# Altium schematic sheet Ups_Design2.SchDoc
size 381 x 241 mm; SheetNumber: 1; SheetTotal: 2
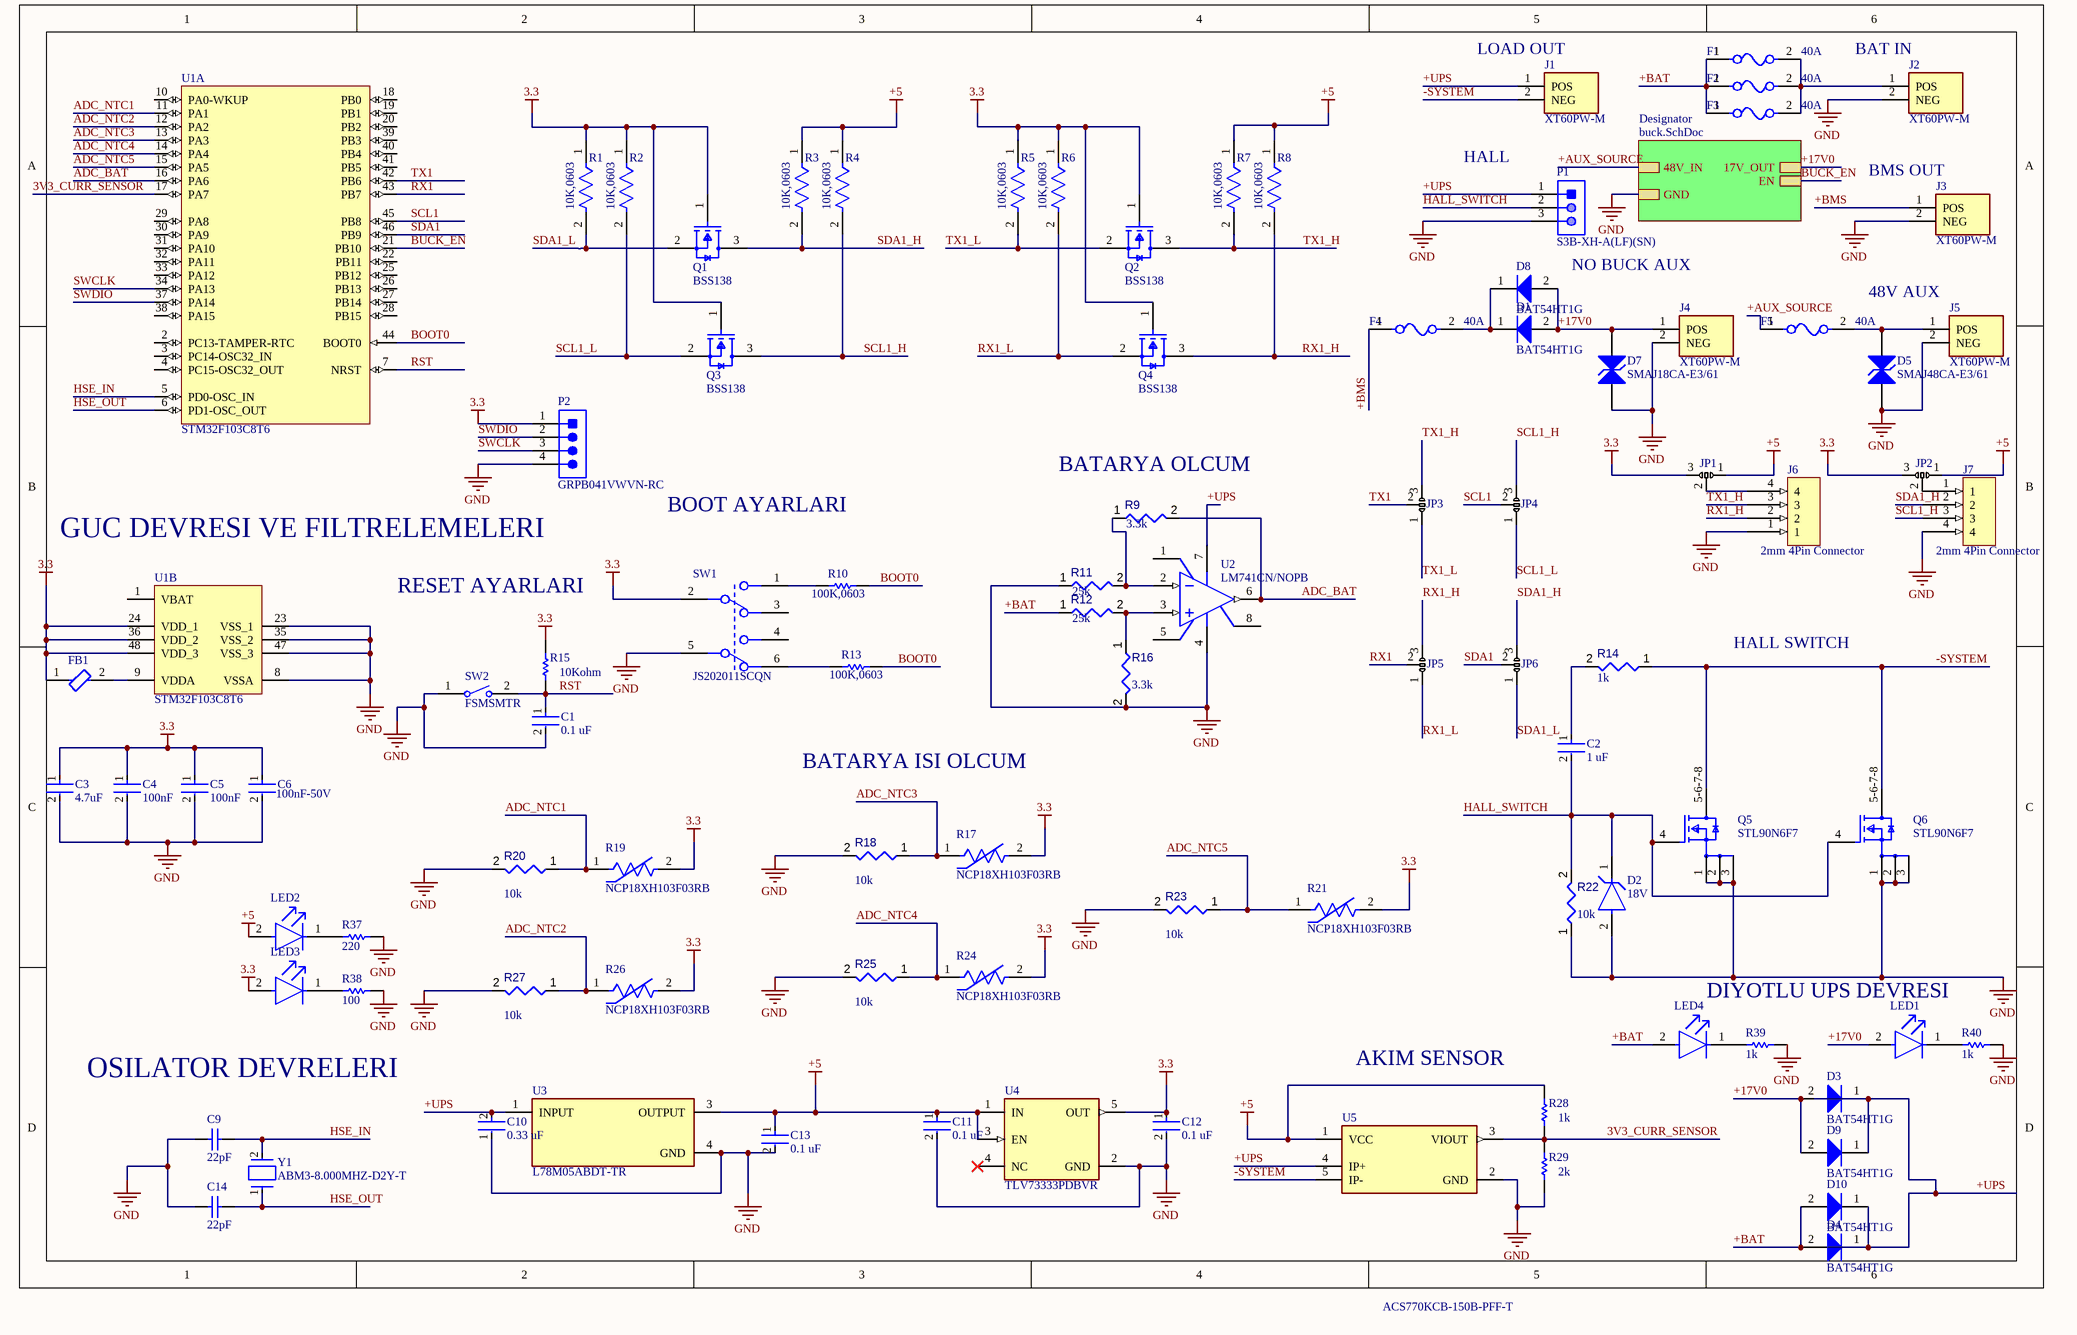
[diagram p0: Ups_Design2.SchDoc]

## Parts
C1  0.1 uF  [FP-GCM188-0_1-IPC_B]
C2  1 uF  [FP-0603-L_1_6_0_15-W_0_8-IPC_C]
C3  4.7uF  [FP-GRM188-0_2-IPC_C]
C4  100nF  [FP-CGA3E-0_3-0_1-IPC_A]
C5  100nF  [FP-CGA3E-0_3-0_1-IPC_A]
C6  100nF-50V  [FP-CGA3E-0_3-0_1-IPC_A]
C9  22pF  [CAPC1608X73X35LL10T15]
C10  0.33 uF  [FP-C1608-080-0_1-IPC_B]
C11  0.1 uF  [FP-GCM188-0_1-IPC_B]
C12  0.1 uF  [FP-GCM188-0_1-IPC_B]
C13  0.1 uF  [FP-GCM188-0_1-IPC_B]
C14  22pF  [CAPC1608X73X35LL10T15]
D1  BAT54HT1G  [ONSC-SOD-323-2-477-02_V]
D2  18V  [FP-SOD123-MFG]
D3  BAT54HT1G  [ONSC-SOD-323-2-477-02_V]
D4  BAT54HT1G  [ONSC-SOD-323-2-477-02_V]
D5  SMAJ48CA-E3/61  [VISH-DO-214AC-2_M]
D7  SMAJ18CA-E3/61  [VISH-DO-214AC-2_L]
D8  BAT54HT1G  [ONSC-SOD-323-2-477-02_V]
D9  BAT54HT1G  [ONSC-SOD-323-2-477-02_V]
D10  BAT54HT1G  [ONSC-SOD-323-2-477-02_V]
F1  40A  [FP-0456040_DR-MFG]
F2  40A  [FP-0456040_DR-MFG]
F3  40A  [FP-0456040_DR-MFG]
F4  40A  [FP-0456040_DR-MFG]
F5  40A  [FP-0456040_DR-MFG]
FB1  BLM18SG221TN1D  [FP-BLM18-0_15-t0_5-IPC_A]  (value not drawn)
J1  XT60PW-M  [AMASS_XT60PW-M]
J2  XT60PW-M  [AMASS_XT60PW-M]
J3  XT60PW-M  [AMASS_XT60PW-M]
J4  XT60PW-M  [AMASS_XT60PW-M]
J5  XT60PW-M  [AMASS_XT60PW-M]
J6  2mm 4Pin Connector  [New footprint 1]
J7  2mm 4Pin Connector  [New footprint 1]
JP1  Jumper Pad 3P  [Jumper Pad 3P-Footprint-1]  (value not drawn)
JP2  Jumper Pad 3P  [Jumper Pad 3P-Footprint-1]  (value not drawn)
JP3  Jumper Pad 3P  [Jumper Pad 3P-Footprint-1]  (value not drawn)
JP4  Jumper Pad 3P  [Jumper Pad 3P-Footprint-1]  (value not drawn)
JP5  Jumper Pad 3P  [Jumper Pad 3P-Footprint-1]  (value not drawn)
JP6  Jumper Pad 3P  [Jumper Pad 3P-Footprint-1]  (value not drawn)
LED1  TLMO1000-GS08  [FP-6_541-5056_01-4-MFG]  (value not drawn)
LED2  TLMO1000-GS08  [FP-6_541-5056_01-4-MFG]  (value not drawn)
LED3  TLMO1000-GS08  [FP-6_541-5056_01-4-MFG]  (value not drawn)
LED4  TLMO1000-GS08  [FP-6_541-5056_01-4-MFG]  (value not drawn)
P1  S3B-XH-A(LF)(SN)  [JST-S3B-XH-A(LF)(SN)_V]
P2  GRPB041VWVN-RC  [SLIN-GRPB041VWVN-RC_V]
Q1  BSS138  [FP-318-08-IPC_B]
Q2  BSS138  [FP-318-08-IPC_B]
Q3  BSS138  [FP-318-08-IPC_B]
Q4  BSS138  [FP-318-08-IPC_B]
Q5  STL90N6F7  [FP-8472137_SUBCON_998G-MFG]
Q6  STL90N6F7  [FP-8472137_SUBCON_998G-MFG]
R1  10K,0603  [FP-ERJ3G-IPC_C]
R2  10K,0603  [FP-ERJ3G-IPC_C]
R3  10K,0603  [FP-ERJ3G-IPC_C]
R4  10K,0603  [FP-ERJ3G-IPC_C]
R5  10K,0603  [FP-ERJ3G-IPC_C]
R6  10K,0603  [FP-ERJ3G-IPC_C]
R7  10K,0603  [FP-ERJ3G-IPC_C]
R8  10K,0603  [FP-ERJ3G-IPC_C]
R9  value 3.3k  [RESC1608X55X25ML10T15]  (hidden comment: 4.7k)
R10  100K,0603  [RESC1608X100X25ML20T15]
R11  25k  [RESC1608X55X25ML10T15]
R12  25k  [RESC1608X55X25ML10T15]
R13  100K,0603  [RESC1608X100X25ML20T15]
R14  1k  [RESC1608X55X25ML10T15]
R15  10Kohm  [RESC1608X55X25ML10T15]
R16  value 3.3k  [RESC1608X55X25ML10T15]  (hidden comment: 4.7k)
R17  NCP18XH103F03RB  [FP-NCP18-0_15-IPC_A]
R18  10k  [RESC1608X55X25ML10T15]
R19  NCP18XH103F03RB  [FP-NCP18-0_15-IPC_A]
R20  10k  [RESC1608X55X25ML10T15]
R21  NCP18XH103F03RB  [FP-NCP18-0_15-IPC_A]
R22  10k  [RESC1608X55X25ML10T15]
R23  10k  [RESC1608X55X25ML10T15]
R24  NCP18XH103F03RB  [FP-NCP18-0_15-IPC_A]
R25  10k  [RESC1608X55X25ML10T15]
R26  NCP18XH103F03RB  [FP-NCP18-0_15-IPC_A]
R27  10k  [RESC1608X55X25ML10T15]
R28  1k  [RESC1608X55X25ML10T15]
R29  2k  [RESC1608X55X25ML10T15]
R37  220  [RESC1608X55X25ML10T15]
R38  100  [RESC1608X55X25ML10T15]
R39  1k  [RESC1608X55X25ML10T15]
R40  1k  [RESC1608X55X25ML10T15]
SW1  JS202011SCQN  [FP-JS202011SCQN-MFG]
SW2  FSMSMTR  [TECO-FSMSMTR_V]
U1  STM32F103C8T6  [STM-LQFP48_L]  (parts A,B of 2)
U2  LM741CN/NOPB  [P0008A]
U3  L78M05ABDT-TR  [FP-L78M05ABDT-TR-MFG]
U4  TLV73333PDBVR  [FP-DBV0005A-MFG]
U5  ACS770KCB-150B-PFF-T  [FP-CB-5-PFF-MFG]
Y1  ABM3-8.000MHZ-D2Y-T  [FP-ABM3-MFG]

## Sub-sheets
Designator = buck.SchDoc: 48V_IN, GND, 17V_OUT, EN

## Nets
3.3: C3.1 C4.1 C5.1 C6.1 C12.1 FB1.1 JP1.3 JP2.3 LED3.2(A) P2.1 Q1.1(G) Q2.1(G) Q3.1(G) Q4.1(G) R1.1 R2.1 R5.1 R6.1 R15.2 R17.2 R19.2 R21.2 R24.2 R26.2 SW1.2 U1.24(VDD_1) U1.36(VDD_2) U1.48(VDD_3) U4.5(OUT)
+5: C11.1 C13.1 JP1.1 JP2.1 LED2.2(A) R3.1 R4.1 R7.1 R8.1 R28.2 U3.3(OUTPUT) U4.1(IN) U4.3(EN) U5.1(VCC)
GND: C1.2 C3.2 C4.2 C5.2 C6.2 C9.1 C10.1 C11.2 C12.2 C13.2 C14.1 D2.2(A) D5.1(A1) D7.1(A1) J2.2(NEG) J3.2(NEG) J4.2(NEG) J5.2(NEG) J6.1 J7.4 P1.3 P2.4 Q5.1(S) Q5.2(S) Q5.3(S) Q6.1(S) Q6.2(S) Q6.3(S) R11.1 R16.2 R18.2 R20.2 R22.1 R23.2 R25.2 R27.2 R29.1 R37.1 R38.1 R39.1 R40.1 SW1.5 SW2.1 U1.8(VSSA) U1.23(VSS_1) U1.35(VSS_2) U1.47(VSS_3) U2.4(V-) U3.4(GND) U4.2(GND) U5.2(GND) ; sheet Designator/GND
3V3_CURR_SENSOR: R28.1 R29.2 U1.17(PA7) U5.3(VIOUT)
+17V0: D1.2(A) D3.2(A) D7.2(A2) D8.2(A) D9.2(A) J4.1(POS) LED1.2(A) ; sheet Designator/17V_OUT
+AUX_SOURCE: F5.1 ; sheet Designator/48V_IN
+BAT: D4.2(A) D10.2(A) F1.1 F2.1 F3.1 LED4.2(A) R12.1
+BMS: F4.1 J3.1(POS)
+UPS: C10.2 D3.1(K) D4.1(K) D9.1(K) D10.1(K) J1.1(POS) P1.1 U2.7(V+) U3.1(INPUT) U5.4(IP+)
-SYSTEM: J1.2(NEG) Q5.5-6-7-8(D) Q6.5-6-7-8(D) R14.1 U5.5(IP-)
ADC_BAT: R9.2 U1.16(PA6) U2.6(OUT)
ADC_NTC1: R19.1 R20.1 U1.11(PA1)
ADC_NTC2: R26.1 R27.1 U1.12(PA2)
ADC_NTC3: R17.1 R18.1 U1.13(PA3)
ADC_NTC4: R24.1 R25.1 U1.14(PA4)
ADC_NTC5: R21.1 R23.1 U1.15(PA5)
BOOT0: R10.1 R13.1 U1.44(BOOT0)
BUCK_EN: U1.21(PB10) ; sheet Designator/EN
HALL_SWITCH: C2.2 D2.1(C) P1.2 Q5.4(G) Q6.4(G) R22.2
HSE_IN: C9.2 U1.5(PD0-OSC_IN) Y1.2
HSE_OUT: C14.2 U1.6(PD1-OSC_OUT) Y1.1
RST: C1.1 R15.1 SW2.2 U1.7(NRST)
RX1: JP5.2 U1.43(PB7)
RX1_H: J6.2 JP5.3 Q4.3(D) R8.2
RX1_L: JP5.1 Q4.2(S) R6.2
SCL1: JP4.2 U1.45(PB8)
SCL1_H: J7.3 JP4.3 Q3.3(D) R4.2
SCL1_L: JP4.1 Q3.2(S) R2.2
SDA1: JP6.2 U1.46(PB9)
SDA1_H: J7.2 JP6.3 Q1.3(D) R3.2
SDA1_L: JP6.1 Q1.2(S) R1.2
SWCLK: P2.3 U1.34(PA13)
SWDIO: P2.2 U1.37(PA14)
TX1: JP3.2 U1.42(PB6)
TX1_H: J6.3 JP3.3 Q2.3(D) R7.2
TX1_L: JP3.1 Q2.2(S) R5.2
NetC2_1: C2.1 R14.2
NetD1_1: D1.1(K) D8.1(K) F4.2
NetD5_2: D5.2(A2) F5.2 J5.1(POS)
NetF1_2: F1.2 F2.2 F3.2 J2.1(POS)
NetFB1_2: FB1.2 U1.9(VDDA)
NetJ6_4: J6.4 JP1.2
NetJ7_1: J7.1 JP2.2
NetLED1_1: LED1.1(C) R40.2
NetLED2_1: LED2.1(C) R37.2
NetLED3_1: LED3.1(C) R38.2
NetLED4_1: LED4.1(C) R39.2
NetR9_1: R9.1 R11.2 U2.2(IN-)
NetR10_2: R10.2 SW1.1
NetR12_2: R12.2 R16.1 U2.3(IN+)
NetR13_2: R13.2 SW1.6

Not connected (* = marked no-connect by the designer): SW1 3 4; U1 1(VBAT) 2(PC13-TAMPER-RTC) 3(PC14-OSC32_IN) 4(PC15-OSC32_OUT) 10(PA0-WKUP) 18(PB0) 19(PB1) 20(PB2) 22(PB11) 25(PB12) 26(PB13) 27(PB14) 28(PB15) 29(PA8) 30(PA9) 31(PA10) 32(PA11) 33(PA12) 38(PA15) 39(PB3) 40(PB4) 41(PB5); U2 1(OFS_NULL) 5(OFS_NULL) 8(NC); U4 4(NC)*

## Notes on the sheet
- (near J1) LOAD OUT
- (near J2) BAT IN
- HALL
- (near J3) BMS OUT
- NO BUCK AUX
- 48V AUX
- (near R9) BATARYA OLCUM
- GUC DEVRESI VE FILTRELEMELERI
- BOOT AYARLARI
- RESET AYARLARI
- HALL SWITCH
- BATARYA ISI OLCUM
- DIYOTLU UPS DEVRESI
- OSILATOR DEVRELERI
- AKIM SENSOR

## Library data of the parts
C1 C11-C13 = CMP-2006-02353-3: Ceramic Capacitor for Automotive 100nF  ±10% 50VDC X8L 0603 Paper T/R; Voltage Rating: 50V; Height: 0.8mm; Lead Free: Lead Free; Case/Package: 0603; Dielectric: X8L; Packaging: Tape and Reel; Termination: SMD/SMT; Package Quantity: 4000; Width: 0.5mm; Max Operating Temperature: 150°C; Case Code (Metric): 1608; Thickness: 0.035inch; Capacitance: 100nF; Tolerance: 10%; Voltage Rating (DC): 50V; Ratings: AEC-Q200; Case Code (Imperial): 0603; Voltage: 50V; Depth: 0.8mm; Radiation Hardening: No; Length: 1.6mm; Mount: Surface Mount; Min Operating Temperature: -55°C
C2 = CMP-2000-07531-4: Ceramic Capacitor General Use 1uF ±10% 50V X7R 0603; Series: M; Width: 0.031inch; Mount: Surface Mount; Radiation Hardening: No; Voltage Rating (DC): 50V; Packaging: Tape and Reel; Termination: SMD/SMT; Depth: 0.8mm; Case Code (Metric): 1608; Case Code (Imperial): 0603; Height: 0.8mm; Voltage Rating: 50V; Package Quantity: 1; Halogen Free: Halogen Free; Dielectric: X7R; Min Operating Temperature: -55°C; Length: 1.6mm; Construction: Flat; Tolerance: 10%; Thickness: 0.037inch; Max Operating Temperature: 125°C; Case/Package: 0603; Capacitance: 1uF; RoHS Compliant: Yes
C3 = CMP-2006-02545-2: Chip Multilayer Ceramic Capacitors for General Purpose, 0603, 4.7uF, X5R, 15%, 10%, 35V; Lead Free: Lead Free; Max Operating Temperature: 85°C; Case Code (Imperial): 0603; Capacitance: 4.7uF; Width: 0.8mm; Thickness: 0.031inch; Case Code (Metric): 1608; Min Operating Temperature: -55°C; Voltage Rating (DC): 35V; Dielectric: X5R; Voltage: 35V; Packaging: Tape and Reel; Resistor Type: Ceramic; Weight: 0.000222oz; Mount: Surface Mount; Material: Ceramic; Depth: 0.8mm; Tolerance: 10%; REACH SVHC: No SVHC; Case/Package: 0603; Voltage Rating: 35V; Package Quantity: 4000; Height: 0.8mm; Length: 1.6mm; Termination: SMD/SMT
C4-C6 = CMP-2000-07546-2: Cap Ceramic 100nF 50V X7R 10% Pad SMD 0603 +125°C Automotive T/R; Weight: 7.1E-05oz; Composition: Ceramic; Max Operating Temperature: 125°C; Termination: SMD/SMT; Dielectric: X7R; Length: 1.6mm; Package Quantity: 1; REACH SVHC: No SVHC; Lead Free: Lead Free; Case Code (Metric): 1608; Min Operating Temperature: -55°C; Packaging: Tape and Reel; Tolerance: 10%; Voltage Rating: 50V; Case Code (Imperial): 0603; Capacitance: 100nF; Case/Package: 0603; Voltage Rating (DC): 50V; Depth: 0.8mm; Radiation Hardening: No; Ratings: AEC-Q200; Mount: Surface Mount; Voltage: 50V; Thickness: 0.035inch; Width: 0.8mm; Height: 0.8mm
C9 C14 = CMP-2006-04604-1: Part Number: 06033J220GBSTR; Manufacturer: AVX Interconnect / Elco
C10 = CMP-2000-07551-2: Multilayer Ceramic Capacitors 330nF ±10% 50V X7R SMD 0603; Capacitance: 330nF; Case Code (Imperial): 0603; Case Code (Metric): 1608; Dielectric: X7R; Length: 1.6mm; Construction: Flat; Resistor Type: Ceramic; Mount: Surface Mount; Voltage Rating: 50V; Packaging: Tape and Reel; Series: C; Case/Package: 0603; Lead Free: Lead Free; Tolerance: 10%; Voltage: 50V; REACH SVHC: No SVHC; Height: 0.8mm; Weight: 7.1E-05oz; Termination: SMD/SMT; Max Operating Temperature: 125°C; RoHS Compliant: Yes; Min Operating Temperature: -55°C; Depth: 0.8mm; Package Quantity: 1; Thickness: 0.037inch; Voltage Rating (DC): 50V; Dielectric Material: Ceramic; Width: 0.031inch
D1 D3 D4 D8-D10 = CMP-1055-00462-1: Schottky Barrier Diode, 2-Pin SOD-323, Pb-Free, Tape and Reel; Manufacturer: On Semiconductor; Configuration: Single; trr Max (ns): 5; IFSM Max (A): 0.6; ComponentLink3URL: http://www.onsemi.com/pub_link/Collateral/477-02.PDF.1; PackageDescription: 2-Pin SOD, Body 1.7 x 1.25 mm; ComponentLink2URL: http://www.onsemi.cn/pub_link/Collateral/BAT54HT1-D.PDF; ComponentLink3Description: Package Specification; ComponentLink2Description: Datasheet; DatasheetVersion: Rev. 6; PackageReference: SOD-323-2-477-02; RoHS: TRUE; ComponentLink1URL: http://www.onsemi.com/; Packing: Tape and Reel; PartNumber: BAT54HT1G; Mounting Technology: Surface Mount; ComponentLink1Description: Manufacturer URL; PackageVersion: Rev. H, 03/2007
D2 = CMP-12792-000007-1: DIODE ZENER 18V 500MW SOD123; Manufacturer: Diodes Inc.; Manufacturer Part Number: BZT52C18-7-F; Max Reverse Leakage Current: 0.1uA; Max Zener Voltage: 19.1V; Max Junction Temp: +150°C; Reverse Voltage: 12.6V; Forward Current: 10mA; Standoff Height: 0mm; Zener Impedance: 45Ω; Power Dissipation: 370mW; Temperature Range Low: -65°C; Package: SOD123; Device Class L3: Zener Diodes; Mouser Description: BZT52C18 Series 500 mW 18 V 10 mA Surface Mount Zener Diode - SOD-123; Octopart: https://octopart.com/bzt52c18-7-f-diodes+inc.-326572; Height: 1.45mm; Device Class L1: Discrete Semiconductors; Nom Zener Voltage: 18V; Automotive: No; Device Class L2: Diodes; Category: Diode; Temperature: -65°C to +150°C; Lead Free: Yes; ComponentLink2URL: https://www.diodes.com/assets/Datasheets/ds18004.pdf; Temperature Range High: +150°C; Footprint Url: https://www.diodes.com/assets/Package-Files/SOD123.pdf; RoHS: TRUE; Digikey Description: DIODE ZENER 18V 500MW SOD123; ComponentLink2Description: Datasheet
D5 = CMP-0548-00214-2: Transient Voltage Suppressor, 6.40 to 231 V, 48 V Stand-off Voltage, Bi-Directional, -55 to 155 degC, 2-pin DO-214AC, Pb-Free, Tape and Reel; Manufacturer: Vishay Semiconductor; PPPM (W): 400, 300; ID (uA): 2; VBR Bi-Directional (V): 6.4 to 231; VWM (V): 48; IFSM: 40 A; Mounting Technology: Surface Mount; PackageReference: DO-214AC-2; ComponentLink1Description: Manufacturer URL; ComponentLink2Description: Datasheet; ComponentLink3Description: Package Specification; PartNumber: SMAJ48CA-E3/61; ComponentLink1URL: http://www.vishay.com/; ComponentLink3URL: http://www.vishay.com/docs/88390/smaj50a.pdf; ComponentLink2URL: http://www.vishay.com/docs/88390/smaj50a.pdf; RoHS: TRUE; Operating Junction and Storage Temperature Range: -55 to 150 degC; PackageDescription: 2-Pin DO-214AC (SMA), Body 4.245 x 2.665 mm; Packing: Tape and Reel; DatasheetVersion: 12/8/2013
D7 = CMP-0548-00180-2: Transient Voltage Suppressor, 6.40 to 231 V, 18 V Stand-off Voltage, Bi-Directional, -55 to 155 degC, 2-pin DO-214AC, Pb-Free, Tape and Reel; Manufacturer: Vishay Semiconductor; VWM (V): 18; IFSM: 40 A; VBR Bi-Directional (V): 6.4 to 231; ID (uA): 2; PPPM (W): 400, 300; PackageDescription: 2-Pin DO-214AC (SMA), Body 4.245 x 2.665 mm; ComponentLink1Description: Manufacturer URL; RoHS: TRUE; ComponentLink3Description: Package Specification; ComponentLink3URL: http://www.vishay.com/docs/88390/smaj50a.pdf; Mounting Technology: Surface Mount; DatasheetVersion: 12/8/2013; ComponentLink1URL: http://www.vishay.com/; ComponentLink2URL: http://www.vishay.com/docs/88390/smaj50a.pdf; PackageReference: DO-214AC-2; ComponentLink2Description: Datasheet; PartNumber: SMAJ18CA-E3/61; Packing: Tape and Reel; Operating Junction and Storage Temperature Range: -55 to 150 degC
F1-F5 = CMP-08605-000062-1: FUSE BOARD MOUNT 40A 60VDC 2SMD; Manufacturer Part Number: 0456040.DR; Manufacturer: Littelfuse Inc; Fuse Blow Speed: Fast; Voltage Rating: 72V; Resistance: 1.05mΩ; Fuse I2T: 191A2Sec; Fuse Interrupt Dc Current: 180A; Value: 1.05mΩ; Fuse Current: 40A; Device Class L2: Fuses; Height: 4.445mm; Device Class L3: unset; Max Fuse Dc Voltage: 72V; Lead Free: Yes; Device Class L1: Circuit Protection; Octopart: https://octopart.com/0456040.dr-littelfuse-18189767; Automotive: No; Temperature: -55°C to +125°C; ComponentLink2Description: Datasheet; RoHS: TRUE; Temperature Range Low: -55°C; Digikey Description: FUSE BOARD MOUNT 40A 60VDC 2SMD; Mouser Description: Surface Mount Fuses 125V V/FA NANO2 40A; ComponentLink2URL: https://www.littelfuse.com/~/media/electronics/datasheets/fuses/littelfuse_fuse_456_datasheet.pdf.pdf; Temperature Range High: +125°C; Package: 0; Category: Fuse
FB1 = CMP-0686-00596-3: Chip Ferrite Bead, 0603, 220Ω @ 100MHz, 25%, 0.04Ω, 2.5A; Impedance: 220R; DC Resistance-Max: 40mR; Number of Circuits: 1; Test Frequency: 100MHz; Material: Ferrite; Lead Free: Lead Free; Width: 0.8mm; Max Current Rating: 2.5A; Termination: SMD/SMT; Depth: 0.95mm; Packaging: Tape and Reel; Case Code (Metric): 1608; DC Current: 2.5A; Weight: 7.1E-05oz; Min Operating Temperature: -55°C; DC Resistance (DCR): 40mR; Max Operating Temperature: 125°C; Core Material: Ferrite; Max DC Current: 2.5A; Case/Package: 0603; REACH SVHC: No SVHC; Height: 0.8mm; Number of Pins: 2; Tolerance: 25%; RoHS Compliant: Yes; Radiation Hardening: No; Current Rating: 2.5A; Number of Lines: 1; Series: BLM18S; Case Code (Imperial): 0603; Length: 1.6mm; Package Quantity: 1
J1-J5 = XT60PW-M: Socket, DC supply, male, PIN: 2; MF: AMASS; Check_prices: https://www.snapeda.com/parts/XT60PW-M/AMASS/view-part/?ref=eda; SnapEDA_Link: https://www.snapeda.com/parts/XT60PW-M/AMASS/view-part/?ref=snap; Price: None; Availability: Not in stock; Package: Package; MP: XT60PW-M; Value: *
J6 J7 = CMP-002-00080-1
JP1-JP6 = CMP-011-00014-1: 3Pin Jumper Pad SWH
LED1-LED4 = CMP-02520-000010-1: LED ORANGE 0603 SMD; Manufacturer: Vishay; Automotive Grade: Grade 2; Luminous Intensity: 7.5mcd; Forward Current: 2mA; Forward Voltage: 1.8V; Led Orientation: Top View; Power Dissipation: 40mW; Max Junction Temp: +120°C; Wavelength: 605nm; Viewing Angle: 160°; Peak Emmision Wavelength: 610nm; Reverse Voltage: 6V; Colour: Orange; Digikey Description: LED ORANGE 0603 SMD; Lead Free: Yes; RoHS: TRUE; Device Class L1: Optoelectronics; Automotive: Yes; Manufacturer Part Number: TLMO1000-GS08; Category: Diode; Device Class L3: unset; Temperature Range Low: -40°C; Temperature Range High: +100°C; Ambient Temperature Range High: +100°C; ComponentLink2URL: http://www.vishay.com/docs/83172/tlmo1000.pdf; Height: 0.65mm; Ambient Temperature Range Low: -40°C; Device Class L2: LEDs; Octopart: https://octopart.com/tlmo1000-gs08-vishay-41955669; Temperature: -40°C to +100°C; ComponentLink2Description: Datasheet; Package: 6.541-5056.01-4
P1 = CMP-1755-00006-1: Male Header, Pitch 2.5 mm, 1 x 3 Position, Height 6.1 mm, Tail Length 3.4 mm, -25 to 85 degC, RoHS, Bulk; Min Supply Voltage: 1 V; Frequency: 1.8 MHz; Channels: 1; Nominal Supply Current: 170 uA; Max Power Dissipation: 1 W; Max Ouput Current: -10 mA; Case\Package: DIP; Max Supply Voltage: 15 V; Min Operating Temperature: 0 degC; Weight: 0.015535 oz; Radiation Hardening: No; ComponentLink1URL: http://www.jst.com/home2.html; PackageReference: S3B-XH-A(LF)(SN); Length: 9.81 mm; Max Operating Temperature: 70 degC; Package Quantity: 50; REACH SVHC: No SVHC; Mount: Through Hole; Pins: 8; Height: 4.57 mm; DatasheetVersion: May-16; ComponentLink1Description: Manufacturer URL; PackageDescription: Male Header, Pitch 2.5 mm, 1 x 3 Position, Height 6.1 mm, Tail Length 3.4 mm; RoHSCompliant: true; Packaging: Rail/Tube; Width: 6.35 mm; ComponentLink2URL: http://www.jst-mfg.com/product/pdf/eng/eXH.pdf; ComponentLink2Description: Datasheet
P2 = CMP-2000-06373-1: Male Header, Pitch 1.27 mm, 1 x 4 Position, Height 4 mm, Tail Length 2.3 mm, -40 to 105 degC, RoHS, Bulk; Manufacturer: Sullins; Mating Products: S9010E-04-ND / -CONNHEADER.050"4POSR/APCB / S9008E-04-ND / -CONNHEADER.050"4POSPCBGOLD / S9005E-04-ND / -CONNHEADER.050"4POSSMDGOLD; Other Names: S9014E-04; Dynamic Catalog: GRPB; Pitch: 0.050"(1.27mm); Number of Positions Loaded: All; Number of Positions: 4; Catalog Drawings: S9014ESeriesTop; Connector Type: Header,Unshrouded; Contact Finish Thickness: Flash; Number of Rows: 1; Contact Type: MalePin; Category: Connectors,Interconnects; Contact Mating Length: 0.118"(3.00mm); Family: RectangularConnectors-Headers,MalePins; Datasheet Version: Rev. C, 12/2008; Contact Finish: Gold; Termination: Solder; Manufacturer URL: http://www.sullinscorp.com/; Mounting Type: ThroughHole; Packaging: Bulk; Package Reference: GRPB041VWVN-RC; Datasheet URL: http://www.sullinscorp.com/drawings/71_GRPB___1VWVN-RC,_10957-C.pdf; Mounting Technology: ThroughHole; Package Description: Male Header, Pitch 1.27 mm, 1 x 4 Position, Height 4 mm, Tail Length 2.3 mm; Standard Package: 1
Q1-Q4 = CMP-07173-000101-1: MOSFET N-CH 50V 220MA SOT-23; Turn-Off Delay Time: 20ns; Element Configuration: Single; Rds On Max: 3.5R; Gate to Source Voltage (Vgs): 20V; Threshold Voltage: 1.3V; Number of Elements: 1; Power Dissipation: 360mW; Rise Time: 9ns; Turn-On Delay Time: 2.5ns; Input Capacitance: 27pF; On-State Resistance: 6R; Lead Free: Lead Free; Length: 2.92mm; Width: 1.3mm; Drain to Source Breakdown Voltage: 50V; Min Operating Temperature: -55°C; REACH SVHC: No SVHC; Packaging: Tape and Reel; Radiation Hardening: No; Height: 0.93mm; Drain to Source Voltage (Vdss): 50V; Current Rating: 220mA; Voltage Rating (DC): 50V; Weight: 0.03g; Continuous Drain Current (ID): 220mA; Number of Pins: 3; Nominal Vgs: 1.3V; Max Power Dissipation: 360mW; Fall Time: 9ns; Drain to Source Resistance: 3.5R; Contact Plating: Tin; Case/Package: SOT-23; Package Quantity: 1; Dual Supply Voltage: 50V; Mount: Surface Mount; Termination: SMD/SMT; Max Operating Temperature: 150°C
Q5 Q6 = CMP-12198-000042-1: MOSFET N-CH 60V 90A POWERFLAT; Rds On Max: 5.4mR; Input Capacitance: 1.6nF; Max Power Dissipation: 94W; Number of Pins: 8; Packaging: Cut Tape; Continuous Drain Current (ID): 90A; Lead Free: Lead Free; Mount: Surface Mount; Drain to Source Voltage (Vdss): 60V; Series: STripFET™ F7
R1-R8 = CMP-2000-00704-2: RES SMD 10K OHM 5% 1/10W 0603; Temperature Coefficient: 200ppm/°C; Max Power Dissipation: 100mW; Resistance: 10kR; Voltage Rating (DC): 50V; Voltage Rating: 75V; Resistor Type: Thick Film; Tolerance: 5%; Military Standard: Not; Package Quantity: 1; Max Operating Temperature: 155°C; Mount: Surface Mount; Technology: THICK FILM; Case/Package: 0603; Construction: Rectangular; Depth: 0.8mm; Case Code (Imperial): 0603; Weight: 7.1E-05oz; Features: Automotive AEC-Q200; Packaging: Tape and Reel; Width: 0.8mm; Length: 1.6mm; Termination: SMD/SMT; Power Rating: 100mW; Lead Free: Lead Free; Number of Terminations: 2; Height: 0.45mm; RoHS Compliant: Yes; Min Operating Temperature: -55°C; Contact Plating: Tin; REACH SVHC: No SVHC; Resistance Tolerance: 5%; Series: ERJ; Working Voltage: 75V; Case Code (Metric): 1608
R9 R11 R12 R14 R16 R18 R20 R22 R23 R25 R27 = CMP-009-00014-4: Chip Resistor, 1 KOhm, +/-1%, 0.1 W, -55 to 155 degC, 0603 (1608 Metric); Power: 100mW; Tolerance: 1%; Voltage Rating: 50V; Max Operating Temperature: 155°C; Pins: 2; RoHS Compliant: True; Case/Package: 0603; Min Operating Temperature: -55°C; Mounting Technology: SM
  R11 R12: Value: 25k
  R14: Value: 1k
  R18 R20 R22 R23 R25 R27: Value: 10k
R10 R13 = CMP-2000-03662-1: Manufacturer: Vishay Dale; Part Number: NTHS0603N01N1003JE
R15 R28 R29 R37-R40 = CMP-2000-04238-1: Manufacturer: Yageo; Part Number: RC0603JR-070RA
R17 R19 R21 R24 R26 = CMP-2000-05271-3: NTC Thermistor for Temperature Sensor, 0603, 10kΩ, 1%, 0.1mA, 5V; Manufacturer Series: NCP18; Accuracy: 0.7%; Current Rating: 310uA; Max Power Dissipation: 100mW; Thermistor Application: TEMPERATURE COMPENSATION; Number of Terminals/Pins: 2; Resistance: 10kR; Case Code (Metric): 1608; RoHS Compliant: Yes; Max Operating Temperature: 125°C; Resistance Tolerance: 1%; Case/Package: 0603; Mount: Surface Mount; Lead Free: Lead Free; Min Operating Temperature: -40°C; REACH SVHC: No SVHC; Package Shape: Rectangular; Radiation Hardening: No; Series: NCP; Depth: 0.8mm; Number of Pins: 2; Length: 1.6mm; Height: 0.8mm; Terminal Placement: Dual; Tolerance: 1%; Case Code (Imperial): 0603; Terminal Finish: Tin; Power Rating: 100mW; Termination: SMD/SMT; Packaging: Tape and Reel; Package Quantity: 1
SW1 = CMP-2000-05087-3: SWITCH SLIDE DPDT 300MA 6V; Switch Function: On-On; Actuator Type: Standard; Switch Travel: 2mm; Actuator Color: Black; Contact Resistance: 70mR; Electrical Life: 5000Cycles; Actuator Material: Nylon; REACH SVHC: No SVHC; Series: JS; Min Operating Temperature: -20°C; Depth: 7.5mm; Housing Material: Nylon; Voltage Rating (DC): 6V; Max Operating Temperature: 85°C; Contact Current Rating: 300mA; Package Quantity: 1; Contact Plating: Silver; Contact Material: Copper Alloy; Throw Configuration: DPDT; Current Rating: 300mA; Orientation: Vertical; Max Current Rating: 300mA; Max Voltage Rating (DC): 6V; Flammability Rating: UL94 V-2; Length: 9mm; Packaging: Tape and Reel; Mount: Surface Mount; Actuator Length: 2mm; Lead Free: Lead Free; Termination: Gull Wing; Radiation Hardening: No
SW2 = CMP-2000-07501-1: FSMSM Push Button Switch, 50 mA, -35 to 85 degC, 2-Pin SMD, RoHS, Tape and Reel; Manufacturer: TE Connectivity; Voltage Rating (DC): 24V; Electrical Life: 20000Cycles; Operating Force: 180gf; Switch Travel: 0.25mm; Contact Current Rating: 50mA; Case\/Package: SMD/SMT; Actuator Length: 1.07mm; Throw Configuration: SPST; Actuator Material: Polyamide; Contact Resistance: 100mOhm; Illumination Type: Illuminated; Max Voltage Rating (DC): 12V; Manufacturer URL: http://www.te.com/; Lead Free: LeadFree; Packaging: TapeandReel; Min Operating Temperature: -35degC; Mechanical Life: 20000Cycles; Mount: SurfaceMount; REACH SVHC: Unknown; Package Quantity: 1800; Package Reference: FSMSMTR; RoHSCompliant: true; Max Operating Temperature: 85degC; Orientation: Straight; ELV: Compliant; Datasheet URL: http://www.te.com/commerce/DocumentDelivery/DDEController?Action=showdoc&DocId=Customer+Drawing%7F1437566-3%7FC2%7Fpdf%7FEnglish%7FENG_CD_1437566-3_C2_1437566_3_1_c.dwg.pdf%7F1437566-4; Package Description: 2-Pin Surface Mount Device, Body 6 x 3.5 mm, Pitch 9.19 mm; Current Rating: 50mA; Contact Plating: Silver; Termination: GullWing; Datasheet Version: Rev. C2, 08/2014; Contact Material: Brass; Mounting Technology: SurfaceMount
U1 = CMP-0237-00215-3: ARM Cortex-M3 32-bit MCU, 64 KB Flash, 20 KB Internal RAM, 37 I/Os, 48-pin LQFP, -40 to 85 degC, Tray; Supply Voltage(Vcc) min (V): 2; Internal RAM Size (kB): 20; FLASH Size (Prog) (kB): 64; A/D Converter: 2x12-bit (10 Channel); I/Os (High Current): 37; Operating Frequency(F) (Processor speed) (MHz): 72; Core: ARM Cortex-M3; ComponentLink3Description: Package Specification; Mounting Technology: Surface Mount; PartNumber: STM32F103C8T6; PackageReference: LQFP48; Packing: Tray; ComponentLink3URL: http://www.st.com/st-web-ui/static/active/en/resource/technical/document/datasheet/DM00058181.pdf; DatasheetVersion: Rev. 16; ComponentLink1URL: http://www.st.com/web/en/home.html; PackageVersion: Rev. 6, 06/2013; ComponentLink2URL: http://www.st.com/st-web-ui/static/active/en/resource/technical/document/datasheet/CD00161566.pdf; ComponentLink1Description: Manufacturer URL; ComponentLink2Description: Datasheet; PackageDescription: 48-Pin Low Profile Quad Flat Package, 7 x 7 mm Body, 0.5 mm Pitch
U2 = CMP-0055-00162-3: Operational Amplifier, 8-pin MDIP, Pb-Free; Manufacturer: Texas Instruments; PackageTopMarking: NSUZXYTTE#*LM*741CN; PowerWise: N; CompType: Amplifiers; ComponentLink1Description: Datasheet URL; ComponentLink1URL: http://www.ti.com/general/docs/lit/getliterature.tsp?genericPartNumber=LM741&fileType=pdf; PackageDescription: MDIP, .365 x .250 x .130in, 8 Lead, .100in Pitch; RoHS: Y; PinCount: 8; Code_JEDEC: MS-001-BA; Package Reference: P0008A
U3 = CMP-0244-00177-2: IC REG LINEAR 5V 500MA DPAK; Polarity: Positive; Accuracy: 2%; Max Input Voltage: 35V; Tolerance: 4%; Power Supply Rejection Ratio (PSRR): 62dB; Dropout Voltage: 2V; Output Type: Fixed; Number of Regulators: 1; Min Input Voltage: 10V; Quiescent Current: 6mA; Mount: Surface Mount; Min Operating Temperature: -40°C; Lead Free: Lead Free; Number of Pins: 3; Height: 2.4mm; Weight: 0.01lb; Width: 6.2mm; Packaging: Tape and Reel; Output Current: 500mA; Output Voltage: 5V; Case/Package: TO-252; REACH SVHC: No SVHC; Max Operating Temperature: 125°C; Nominal Output Voltage: 5V; Number of Outputs: 1; Min Output Voltage: 5V; Radiation Hardening: No; Length: 6.6mm; Max Output Current: 500mA; Contact Plating: Tin; Output Voltage Accuracy: 2%; Package Quantity: 1
U4 = CMP-04917-000053-1: IC REG LINEAR 3.3V 300MA SOT23-5; Manufacturer: Texas Instruments; Max Junction Temp: +125°C; Accuracy Percentage: 1%; Min Supply Voltage: 1.4V; Number Of Outputs: 1; Dropout Voltage: 125mV; Nominal Supply Current: 34uA; Max Supply Voltage: 5.5V; Output Type: Fixed; Standoff Height: 0mm; Digikey Description: IC REG LINEAR 3.3V 300MA SOT23-5; Manufacturer Part Number: TLV73333PDBVR; Temperature Range High: +125°C; Temperature: -40°C to +125°C; Output Current: 300mA; Mouser Description: LDO Voltage Regulators Capacitr-Free 300-mA 5-SOT-23 -40 to 125; Automotive: No; Height: 1.45mm; Device Class L3: Voltage Regulators - Linear; ComponentLink2Description: Datasheet; Device Class L1: Integrated Circuits (ICs); ComponentLink2URL: http://www.ti.com/lit/ds/symlink/tlv733p.pdf; Octopart: https://octopart.com/tlv73333pdbvr-texas+instruments-51080890; Temperature Range Low: -40°C; RoHS: TRUE; Lead Free: Yes; Output Voltage: 3.3V; Package: DBV0005A; Device Class L2: Power Management ICs; Category: IC
U5 = CMP-82923-000167-2: SENSOR CURRENT HALL 150A AC/DC; Polarity: Bidirectional; Max Supply Current: 15mA; Quiescent Current: 10mA; Number of Channels: 1; Linearity: 1%; Sensitivity: 13.3mV/A; Frequency: 120kHz; Accuracy: 0.6%; Response Time: 4.6us; Max Operating Temperature: 125°C; Package Quantity: 34; Packaging: Rail/Tube; RoHS Compliant: Yes; Case/Package: 125; Bandwidth: 120kHz; Current Sensing: 150A; Min Operating Temperature: -40°C; Mount: Through Hole; Number of Pins: 5
Y1 = CMP-2000-05033-2: Crystal 8MHz ±20ppm 18pF SMD-2 5mm x 3.2mm; Series Resistance: 500R; Frequency Stability: 30ppm; ESR (Equivalent Series Resistance): 140R; Load Capacitance: 18pF; Height: 0.051inch; Tolerance: 20ppm; Depth: 3.2mm; Max Operating Temperature: 85°C; Frequency: 8MHz; Termination: SMD/SMT; Lead Free: Lead Free; Number of Pins: 2; Width: 3.2mm; RoHS Compliant: Yes; Resistor Type: Ceramic; Length: 5mm; Mount: Surface Mount; Case/Package: CSMD; Package Quantity: 1000; Radiation Hardening: No; Min Operating Temperature: -40°C; Packaging: Tape and Reel; Frequency Tolerance: 20ppm